# Altium schematic sheet RXTRA.SchDoc
size A; SheetNumber: 6; SheetTotal: 6
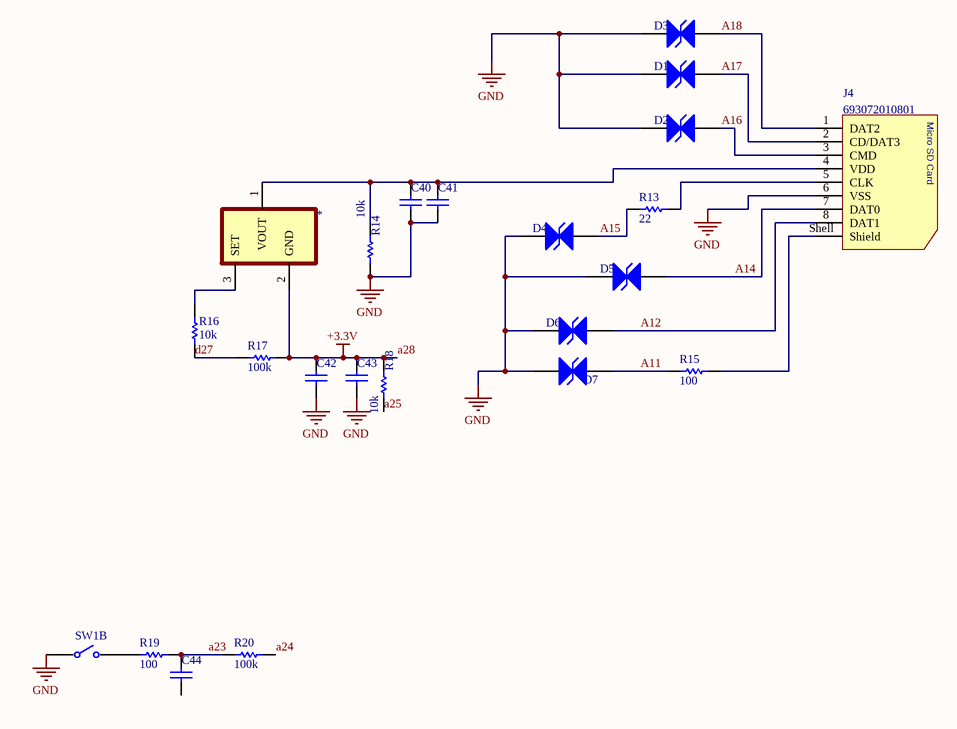
[diagram p0: RXTRA.SchDoc]

## Parts
*  Component_1  (value not drawn)
C40  (no value)  [CAPC1005X56X25LL10T15]
C41  (no value)  [CAPC1005X56X25LL10T15]
C42  (no value)  [CAPC1005X56X25LL10T15]
C43  (no value)  [CAPC1005X56X25LL10T15]
C44  (no value)  [CAPC1005X56X25LL10T15]
D1  824541700  [WE-TVSP_DO-214AB_Bidirectional]  (value not drawn)
D2  824541700  [WE-TVSP_DO-214AB_Bidirectional]  (value not drawn)
D3  824541700  [WE-TVSP_DO-214AB_Bidirectional]  (value not drawn)
D4  824541700  [WE-TVSP_DO-214AB_Bidirectional]  (value not drawn)
D5  824541700  [WE-TVSP_DO-214AB_Bidirectional]  (value not drawn)
D6  824541700  [WE-TVSP_DO-214AB_Bidirectional]  (value not drawn)
D7  824541700  [WE-TVSP_DO-214AB_Bidirectional]  (value not drawn)
J4  693072010801  [693072010801]
R13  22  [RESC1005X40X25LL05T10]
R14  10k  [RESC1005X40X25LL05T10]
R15  100  [RESC1005X40X25LL05T10]
R16  10k  [RESC1005X40X25LL05T10]
R17  100k  [RESC1005X40X25LL05T10]
R18  10k  [RESC1005X40X25LL05T10]
R19  100  [RESC1005X40X25LL05T10]
R20  100k  [RESC1005X40X25LL05T10]
SW1  1825057-1  [FP-1825057-1-MFG]  (value not drawn)  (part B of 2)

## Nets
a28: *.2(GND) C42.2 C43.2 R17.1 R18.2  [also labelled +3.3V]
GND: C40.1 C41.1 C42.1 C43.1 D1.1 D2.1 D3.1 D4.1 D5.1 D6.1 D7.2 J4.6(VSS) R14.1 SW1.2
A11: D7.1 R15.2
A12: D6.2 J4.8(DAT1)
A14: D5.2 J4.7(DAT0)
A15: D4.2 R13.2
A16: D2.2 J4.3(CMD)
A17: D1.2 J4.2(CD/DAT3)
A18: D3.2 J4.1(DAT2)
a23: C44.2 R19.1 R20.2
a24: R20.1
a25: R18.1
d27: R16.1 R17.2
Net*_1: *.1(VOUT) C40.2 C41.2 J4.4(VDD) R14.2
Net*_3: *.3(SET) R16.2
NetJ4_5: J4.5(CLK) R13.1
NetJ4_Shell: J4.Shell(Shield) R15.1
NetR19_2: R19.2 SW1.3

Not connected (* = marked no-connect by the designer): C44 1

## Notes on the sheet
- (in symbol CMP-1502-00164-3) Micro SD Card

## Library data of the parts
C40-C44 = CMP-2008-02962-1
D1-D7 = CMP-03913-71101710-2: TVS diode [Würth Elektronik] 824541700 TVS diode; Leakage Current: 400µA; Polarity: Bidirectional; Min Breakdown Voltage: 8.19V; Peak Pulse Power: 1.5kW; Clamping Voltage: 12V; Peak Pulse Current: 125A; Number of Bidirectional Channels: 1; Reverse Standoff Voltage: 7V; Power Line Protection: No; Composition: Zener; REACH SVHC: Unknown; Packaging: Cut Tape; Mount: Surface Mount; Length: 6.86mm; RoHS: Compliant; Width: 5.91mm; Number of Pins: 2; Max Operating Temperature: 150°C; Max Breakdown Voltage: 8.19V; Min Operating Temperature: -65°C; Height: 2.5mm
J4 = CMP-1502-00164-3: Conn, Memory Skt, Microsd, 8POS, Hinged Rohs Compliant: Yes; Insulation Resistance: 1GΩ; Connector Type: Connector; Memory Type: FLASH; Number of Contacts: 8; Voltage Rating: 100V; Current Rating: 500mA; Contact Material: Gold; Min Operating Temperature: -25°C; Number of Pins: 8; Contact Plating: Gold; REACH SVHC: Unknown; RoHS: Compliant; Color: Black; Number of Positions: 8; Mount: Surface Mount; Length: 14.5mm; Height: 1.95mm; Packaging: Tape and Reel; Max Operating Temperature: 85°C; Width: 13.5mm; Operating Supply Voltage: 100V
R13-R20 = CMP-2002-07161-1
  R13: VALUE: 22
  R14 R16 R18: VALUE: 10k
  R15 R19: VALUE: 100
  R17 R20: VALUE: 100k
SW1 = CMP-03400-000012-1: SWITCH SLIDE DIP SPST 100MA 24V; Manufacturer: TE Connectivity; Contact Resistance: 50mΩ; Electromechanical Life: 1000Cycles; Standoff Height: 1.3mm; Number Of Circuits: 2; Description: Switch DIP OFF ON SPST 2 Raised Slide 0.1A 24VDC PC Pins 2.54mm Thru-Hole Tube; Contact Current Rating: 100mA; ComponentLink2URL: https://www.te.com/commerce/DocumentDelivery/DDEController?Action=srchrtrv&DocNm=1825057&DocType=Customer+Drawing&DocLang=English; Digikey Description: SWITCH SLIDE DIP SPST 100MA 24V; Temperature: -30°C to +85°C; Lead Free: Yes; ComponentLink2Description: Datasheet; Octopart: https://octopart.com/1825057-1-te+connectivity-46507313; Manufacturer Part Number: 1825057-1; Automotive: No; Voltage Rating Dc: 24V; RoHS: TRUE; Package: 1825057-1; Device Class L1: Electromechanical; Temperature Range Low: -30°C; Device Class L2: Switches; Mount: Through Hole; Device Class L3: DIP Switches; Height: 6.15mm; Category: Switch; Temperature Range High: +85°C; Throw Configuration: SPST